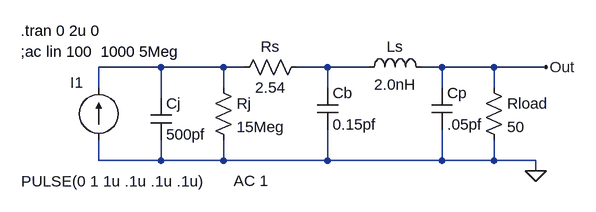
[diagram p0: schematic Photodetector_1Mbs.asc]
Photodetector_1Mbs.asc, the LTspice schematic file:
Version 4
SHEET 1 1052 692
WIRE 544 192 592 192
WIRE 848 192 848 224
WIRE 768 192 848 192
WIRE 848 304 848 336
WIRE 848 336 912 336
WIRE 912 336 912 352
WIRE 240 192 336 192
WIRE 336 192 336 240
WIRE 336 304 336 336
WIRE 336 336 240 336
WIRE 336 192 432 192
WIRE 592 336 432 336
WIRE 240 224 240 192
WIRE 240 336 240 304
WIRE 592 224 592 192
WIRE 592 336 592 288
WIRE 432 224 432 192
WIRE 432 192 464 192
WIRE 432 304 432 336
WIRE 432 336 336 336
WIRE 592 336 768 336
WIRE 592 192 656 192
WIRE 736 192 768 192
WIRE 848 192 928 192
WIRE 768 192 768 224
WIRE 768 288 768 336
WIRE 768 336 848 336
FLAG 912 352 0
FLAG 928 192 Out
SYMBOL res 832 208 R0
SYMATTR InstName Rload
SYMATTR Value 50
SYMBOL res 448 208 R270
WINDOW 0 32 56 VTop 0
WINDOW 3 0 56 VBottom 0
SYMATTR InstName Rs
SYMATTR Value 2.54
SYMBOL ind 640 208 R270
WINDOW 0 32 56 VTop 0
WINDOW 3 5 56 VBottom 0
SYMATTR InstName Ls
SYMATTR Value 2.0nH
SYMBOL cap 320 240 R0
SYMATTR InstName Cj
SYMATTR Value 500pf
SYMBOL current 240 304 R180
WINDOW 3 -164 -64 Left 0
WINDOW 123 -261 -63 Left 0
WINDOW 39 0 0 Left 0
WINDOW 0 24 88 Left 0
SYMATTR Value PULSE(0 1 1u .1u .1u .1u)
SYMATTR Value2 AC 1
SYMATTR InstName I1
SYMBOL cap 576 224 R0
SYMATTR InstName Cb
SYMATTR Value 0.15pf
SYMBOL res 416 208 R0
SYMATTR InstName Rj
SYMATTR Value 15Meg
SYMBOL cap 752 224 R0
SYMATTR InstName Cp
SYMATTR Value .05pf
TEXT 120 136 Left 0 !.tran 0 2u 0
TEXT 120 168 Left 0 !;ac lin 100  1000 5Meg

The netlist it stands for:
* Photodetector_1Mbs.asc
Rload Out 0 50
Rs N002 N001 2.54
Ls N001 Out 2.0nH
Cj N002 0 500pf
I1 0 N002 PULSE(0 1 1u .1u .1u .1u) AC 1
Cb N001 0 0.15pf
Rj N002 0 15Meg
Cp Out 0 .05pf
.tran 0 2u 0
;ac lin 100  1000 5Meg
.backanno
.end